# EAGLE design storm32-nt-v4 (EAGLE 6.1)

## Sheet 1 of 2
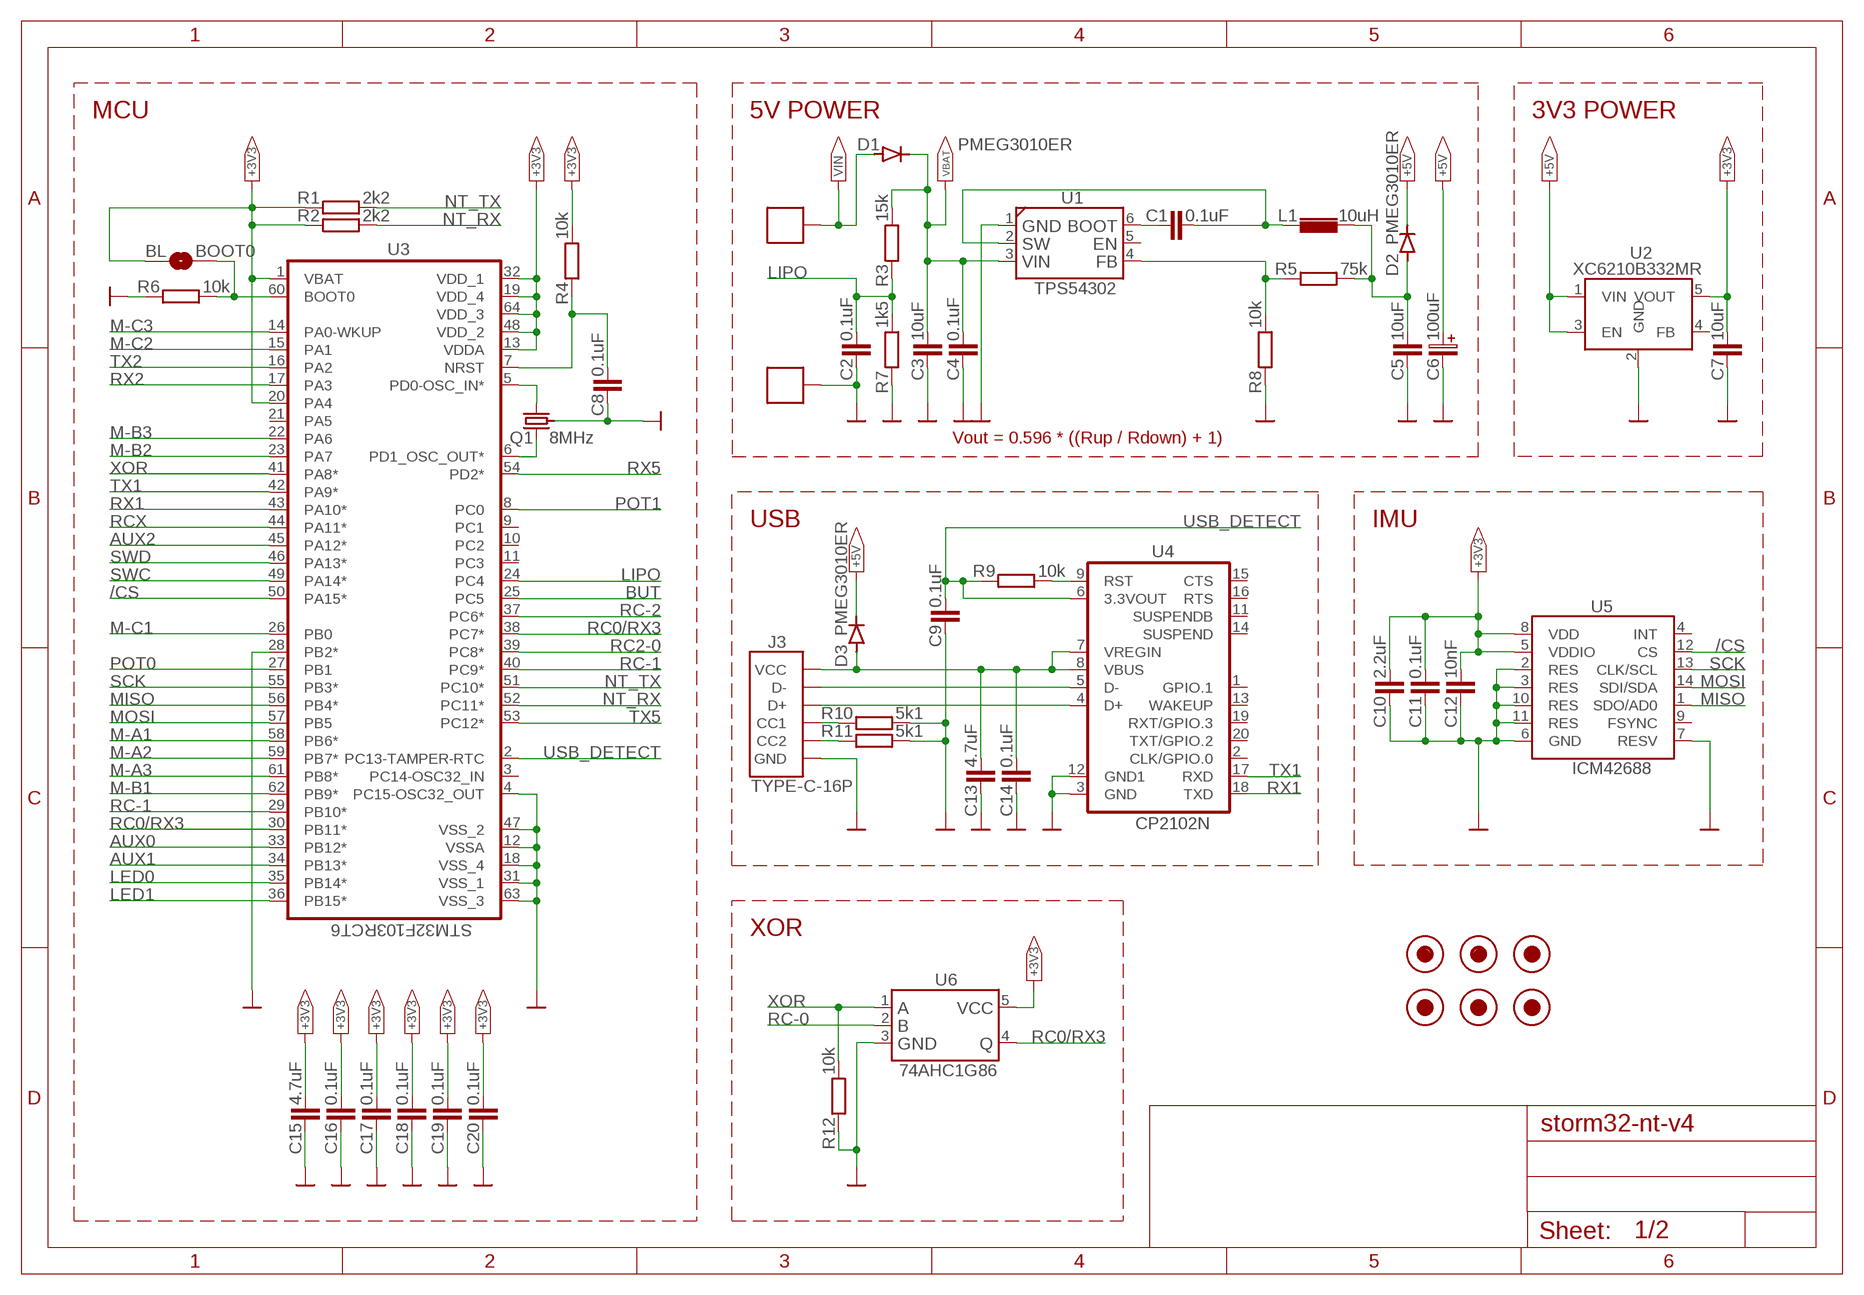
[diagram p0: schematic, sheet 1]

### Parts
BL  BOOT0  __SPARKFUN2_SOLDERJUMPERNO  [__SPARKFUN2_SJ_2S-NO]
C1  0.1uF  CAPACITOR-0402[1005-METRIC]  [0402[1005-METRIC]]
C2  0.1uF  CAPACITOR-0402[1005-METRIC]  [0402[1005-METRIC]]
C3  10uF  CAPACITOR-1206[3216-METRIC]  [1206[3216-METRIC]]
C4  0.1uF  CAPACITOR-0603[1608-METRIC]  [0603[1608-METRIC]]
C5  10uF  CAPACITOR-0603[1608-METRIC]  [0603[1608-METRIC]]
C6  100uF  CAPACITOR-POL-1206[3216-METRIC][CASE-A]  [1206[3216-METRIC]-POL]
C7  10uF  CAPACITOR-0603[1608-METRIC]  [0603[1608-METRIC]]
C8  0.1uF  CAPACITOR-0402[1005-METRIC]  [0402[1005-METRIC]]
C9  0.1uF  CAPACITOR-0402[1005-METRIC]  [0402[1005-METRIC]]
C10  2.2uF  CAPACITOR-0402[1005-METRIC]  [0402[1005-METRIC]]
C11  0.1uF  CAPACITOR-0402[1005-METRIC]  [0402[1005-METRIC]]
C12  10nF  CAPACITOR-0402[1005-METRIC]  [0402[1005-METRIC]]
C13  4.7uF  CAPACITOR-0402[1005-METRIC]  [0402[1005-METRIC]]
C14  0.1uF  CAPACITOR-0402[1005-METRIC]  [0402[1005-METRIC]]
C15  4.7uF  CAPACITOR-0402[1005-METRIC]  [0402[1005-METRIC]]
C16  0.1uF  CAPACITOR-0402[1005-METRIC]  [0402[1005-METRIC]]
C17  0.1uF  CAPACITOR-0402[1005-METRIC]  [0402[1005-METRIC]]
C18  0.1uF  CAPACITOR-0402[1005-METRIC]  [0402[1005-METRIC]]
C19  0.1uF  CAPACITOR-0402[1005-METRIC]  [0402[1005-METRIC]]
C20  0.1uF  CAPACITOR-0402[1005-METRIC]  [0402[1005-METRIC]]
D1  PMEG3010ER  DIODE-SOD-123  [SOD-123]
D2  PMEG3010ER  DIODE-SOD-123  [SOD-123]
D3  PMEG3010ER  DIODE-SOD-123  [SOD-123]
FIDUCIAL1  FIDUCIAL  [FIDUCIAL]
FIDUCIAL2  FIDUCIAL  [FIDUCIAL]
FIDUCIAL3  FIDUCIAL  [FIDUCIAL]
FIDUCIAL4  FIDUCIAL  [FIDUCIAL]
FIDUCIAL5  FIDUCIAL  [FIDUCIAL]
FIDUCIAL6  FIDUCIAL  [FIDUCIAL]
J1  +  1  [1]
J2  -  1  [1]
J3  TYPE-C-16P  [TYPE-C-16P]
L1  10uH  FERRITE/INDUCTOR-4X4  [4X4]
Q1  8MHz  CRYSTAL-GND-RESONATOR  [RESONATOR]
R1  2k2  RESISTOR-0402[1005-METRIC]  [0402[1005-METRIC]]
R2  2k2  RESISTOR-0402[1005-METRIC]  [0402[1005-METRIC]]
R3  15k  RESISTOR-0402[1005-METRIC]  [0402[1005-METRIC]]
R4  10k  RESISTOR-0402[1005-METRIC]  [0402[1005-METRIC]]
R5  75k  RESISTOR-0402[1005-METRIC]  [0402[1005-METRIC]]
R6  10k  RESISTOR-0402[1005-METRIC]  [0402[1005-METRIC]]
R7  1k5  RESISTOR-0402[1005-METRIC]  [0402[1005-METRIC]]
R8  10k  RESISTOR-0402[1005-METRIC]  [0402[1005-METRIC]]
R9  10k  RESISTOR-0402[1005-METRIC]  [0402[1005-METRIC]]
R10  5k1  RESISTOR-0402[1005-METRIC]  [0402[1005-METRIC]]
R11  5k1  RESISTOR-0402[1005-METRIC]  [0402[1005-METRIC]]
R12  10k  RESISTOR-0402[1005-METRIC]  [0402[1005-METRIC]]
U1  TPS54302  SOT23-6  [SOT-23-6]
U2  XC6210B332MR  REGULATOR_EN_FB  [SOT-23-5]
U3  STM32F103RCT6  [QFP50P1200X1200X160-64N]
U4  CP2102N  [QFN-20]
U5  ICM42688  ICM42605  [LGA14]
U6  74AHC1G86  SOT23-5  [SOT-23-5]

### Nets
+3V3: BL.2 C7.P$1 C10.P$1 C11.P$1 C12.P$1 C15.P$1 C16.P$1 C17.P$1 C18.P$1 C19.P$1 C20.P$1 R1.P$1 R2.P$1 R4.P$2 U2.5(VOUT) U3.1(VBAT) U3.13(VDDA) U3.19(VDD_4) U3.20(PA4) U3.32(VDD_1) U3.48(VDD_2) U3.64(VDD_3) U5.5(VDDIO) U5.8(VDD) U6.5 ; also sheet 2
+5V: C6.P D2.C D3.C U2.1(VIN) U2.3(EN) ; also sheet 2
/CS: U3.50(PA15*) U5.12(CS)
AUX0: U3.33(PB12*) ; also sheet 2
AUX1: U3.34(PB13*) ; also sheet 2
AUX2: U3.45(PA12*)
BUT: U3.25(PC5) ; also sheet 2
GND: C2.P$2 C3.P$2 C4.P$2 C5.P$2 C6.N C7.P$2 C8.P$2 C9.P$2 C10.P$2 C11.P$2 C12.P$2 C13.P$2 C14.P$2 C15.P$2 C16.P$2 C17.P$2 C18.P$2 C19.P$2 C20.P$2 J2.1 J2.1A J3.A1(GND) J3.A12(GND) J3.B1(GND) J3.B12(GND) J3.G1(GND) J3.G2(GND) J3.G3(GND) J3.G4(GND) Q1.G(GND) R6.P$1 R7.P$1 R8.P$1 R10.P$2 R11.P$2 R12.P$2 U1.1 U2.2(GND) U3.4(PC15-OSC32_OUT) U3.12(VSSA) U3.18(VSS_4) U3.28(PB2*) U3.31(VSS_1) U3.47(VSS_2) U3.63(VSS_3) U4.3(GND) U4.12(GND1) U5.2(RES) U5.3(RES) U5.6(GND) U5.7(RESV) U5.10(RES) U5.11(RES) U6.3 ; also sheet 2
LED0: U3.35(PB14*) ; also sheet 2
LED1: U3.36(PB15*) ; also sheet 2
LIPO: C2.P$1 R3.P$1 R7.P$2 U3.24(PC4)
M-A1: U3.58(PB6*) ; also sheet 2
M-A2: U3.59(PB7*) ; also sheet 2
M-A3: U3.61(PB8*) ; also sheet 2
M-B1: U3.62(PB9*) ; also sheet 2
M-B2: U3.23(PA7) ; also sheet 2
M-B3: U3.22(PA6) ; also sheet 2
M-C1: U3.26(PB0) ; also sheet 2
M-C2: U3.15(PA1) ; also sheet 2
M-C3: U3.14(PA0-WKUP) ; also sheet 2
MISO: U3.56(PB4*) U5.1(SDO/AD0)
MOSI: U3.57(PB5) U5.14(SDI/SDA)
N$1: J3.A5(CC1) R10.P$1
N$2: J3.B5(CC2) R11.P$1
N$3: C1.P$1 L1.1 U1.2
N$4: Q1.1 U3.6(PD1_OSC_OUT*)
N$5: Q1.2 U3.5(PD0-OSC_IN*)
N$6: C8.P$1 R4.P$1 U3.7(NRST)
N$7: C1.P$2 U1.6
N$9: J3.A6(D+) J3.B6(D+) U4.4(D+)
N$10: J3.A7(D-) J3.B7(D-) U4.5(D-)
N$11: C13.P$1 C14.P$1 D3.A J3.A4(VCC) J3.A9(VCC) J3.B4(VCC) J3.B9(VCC) U4.7(VREGIN) U4.8(VBUS)
N$12: R9.P$2 U4.9(RST)
N$13: R5.P$1 R8.P$2 U1.4
N$18: C5.P$1 D2.A L1.2 R5.P$2
N$29: BL.1 R6.P$2 U3.60(BOOT0)
NT_RX: R2.P$2 U3.52(PC11*) ; also sheet 2
NT_TX: R1.P$2 U3.51(PC10*) ; also sheet 2
POT0: U3.27(PB1) ; also sheet 2
POT1: U3.8(PC0) ; also sheet 2
RC0/RX3: U3.30(PB11*) U3.38(PC7*) U6.4
RC2-0: U3.39(PC8*) ; also sheet 2
RC-0: U6.2 ; also sheet 2
RC-1: U3.29(PB10*) U3.40(PC9*) ; also sheet 2
RC-2: U3.37(PC6*) ; also sheet 2
RCX: U3.44(PA11*)
RX1: U3.43(PA10*) U4.18(TXD)
RX2: U3.17(PA3) ; also sheet 2
RX5: U3.54(PD2*) ; also sheet 2
SCK: U3.55(PB3*) U5.13(CLK/SCL)
SWC: U3.49(PA14*) ; also sheet 2
SWD: U3.46(PA13*) ; also sheet 2
TX1: U3.42(PA9*) U4.17(RXD)
TX2: U3.16(PA2) ; also sheet 2
TX5: U3.53(PC12*) ; also sheet 2
USB_DETECT: C9.P$1 R9.P$1 U3.2(PC13-TAMPER-RTC) U4.6(3.3VOUT)
VBAT: C3.P$1 C4.P$1 D1.C R3.P$2 U1.3 ; also sheet 2
VIN: D1.A J1.1 J1.1A ; also sheet 2
XOR: R12.P$1 U3.41(PA8*) U6.1
Unconnected: U1.5 U2.4(FB) U3.3(PC14-OSC32_IN) U3.9(PC1) U3.10(PC2) U3.11(PC3) U3.21(PA5) U4.1(GPIO.1) U4.2(CLK/GPIO.0) U4.11(SUSPENDB) U4.13(WAKEUP) U4.14(SUSPEND) U4.15(CTS) U4.16(RTS) U4.19(RXT/GPIO.3) U4.20(TXT/GPIO.2) U5.4(INT) U5.9(FSYNC)

### Notes on the sheet
- MCU | 5V POWER | 3V3 POWER
- Vout = 0.596 * ((Rup / Rdown) + 1)
- USB | IMU
- XOR

## Sheet 2 of 2
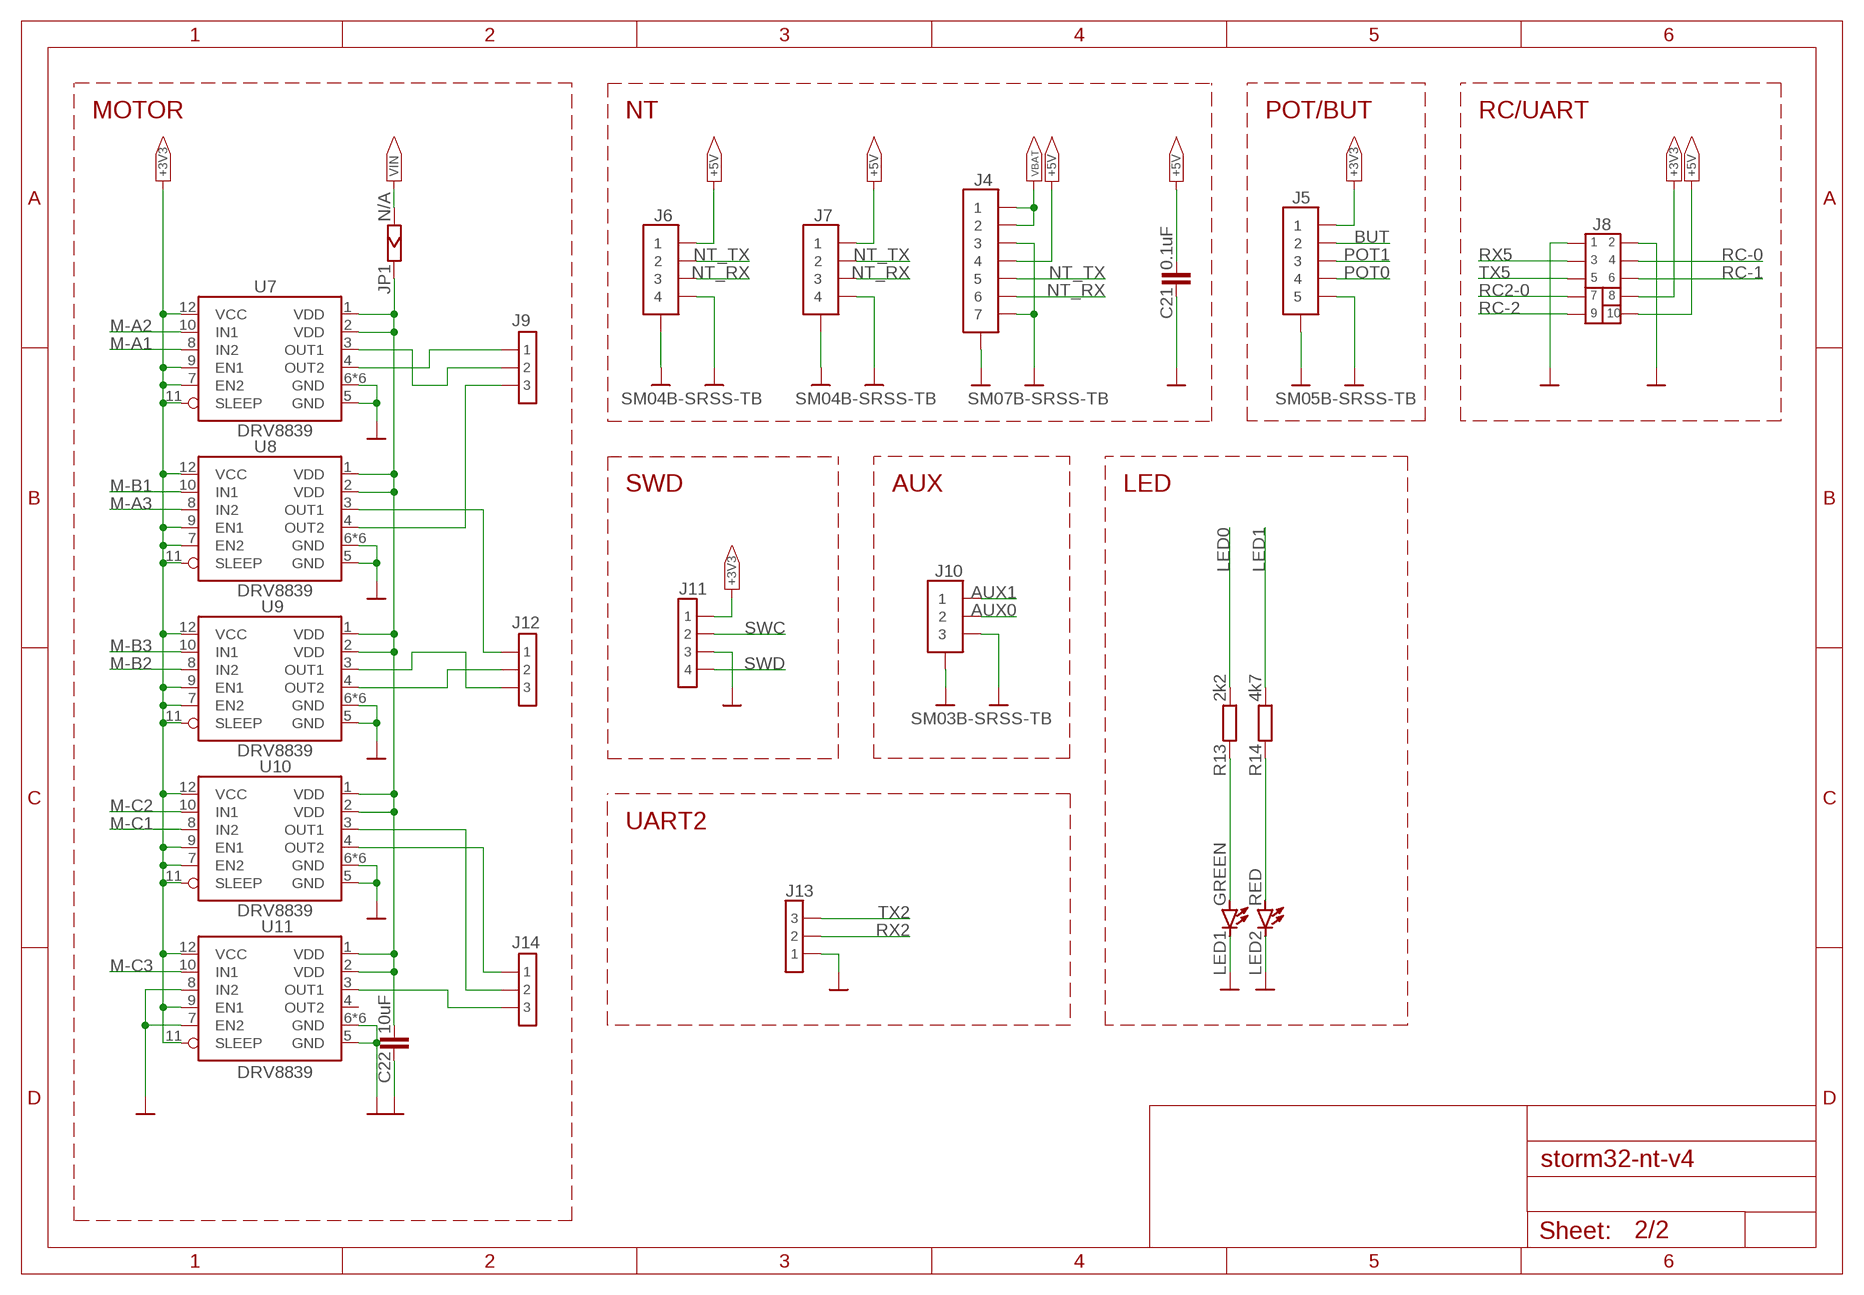
[diagram p1: schematic, sheet 2]

### Parts
C21  0.1uF  CAPACITOR-0402[1005-METRIC]  [0402[1005-METRIC]]
C22  10uF  CAPACITOR-1206[3216-METRIC]  [1206[3216-METRIC]]
J4  SM07B-SRSS-TB  [SM07B-SRSS-TB]
J5  SM05B-SRSS-TB  [SM05B-SRSS-TB]
J6  SM04B-SRSS-TB  [SM04B-SRSS-TB]
J7  SM04B-SRSS-TB  [SM04B-SRSS-TB]
J8  HEADER  [2X5]
J9  HEADER_THT_2.54X1N_MALE-03-2.54-2.54  [HEADER_THT_2.54X1N_MALE-03]
J10  SM03B-SRSS-TB  [SM03B-SRSS-TB]
J11  HEADER_THT_1.27X1N_MALE-04-1.27-1.27  [HEADER_THT_1.27X1N_MALE-04]
J12  HEADER_THT_2.54X1N_MALE-03-2.54-2.54  [HEADER_THT_2.54X1N_MALE-03]
J13  HEADER_THT_2.54X1N_MALE-03-2.54-2.54  [HEADER_THT_2.54X1N_MALE-03]
J14  HEADER_THT_2.54X1N_MALE-03-2.54-2.54  [HEADER_THT_2.54X1N_MALE-03]
JP1  N/A  RESISTOR-0OHM-OFF  [0603[1608-METRIC]-0OHM-OFF]
LED1  GREEN  LED-0603[1608-METRIC]  [0603[1608-METRIC]-DIODE]
LED2  RED  LED-0603[1608-METRIC]  [0603[1608-METRIC]-DIODE]
R13  2k2  RESISTOR-0402[1005-METRIC]  [0402[1005-METRIC]]
R14  4k7  RESISTOR-0402[1005-METRIC]  [0402[1005-METRIC]]
U7  DRV8839  [WSON12]
U8  DRV8839  [WSON12]
U9  DRV8839  [WSON12]
U10  DRV8839  [WSON12]
U11  DRV8839  [WSON12]

### Nets
+3V3: J5.1 J8.8 J11.1 U7.7(EN2) U7.9(EN1) U7.11(SLEEP) U7.12(VCC) U8.7(EN2) U8.9(EN1) U8.11(SLEEP) U8.12(VCC) U9.7(EN2) U9.9(EN1) U9.11(SLEEP) U9.12(VCC) U10.7(EN2) U10.9(EN1) U10.11(SLEEP) U10.12(VCC) U11.9(EN1) U11.11(SLEEP) U11.12(VCC) ; also sheet 1
+5V: C21.P$1 J4.4 J6.1 J7.1 J8.10 ; also sheet 1
AUX0: J10.2 ; also sheet 1
AUX1: J10.1 ; also sheet 1
BUT: J5.2 ; also sheet 1
GND: C21.P$2 C22.P$2 J4.3 J4.7 J4.FIT@1 J4.FIT@2 J5.5 J5.FIT@1 J5.FIT@2 J6.4 J6.FIT@1 J6.FIT@2 J7.4 J7.FIT@1 J7.FIT@2 J8.1 J8.2 J10.3 J10.FIT@1 J10.FIT@2 J11.3 J13.1 LED1.C LED2.C U7.5(GND) U7.6(GND) U7.GND1(GND) U7.GND2(GND) U7.GND3(GND) U7.GND4(GND) U7.GND5(GND) U8.5(GND) U8.6(GND) U8.GND1(GND) U8.GND2(GND) U8.GND3(GND) U8.GND4(GND) U8.GND5(GND) U9.5(GND) U9.6(GND) U9.GND1(GND) U9.GND2(GND) U9.GND3(GND) U9.GND4(GND) U9.GND5(GND) U10.5(GND) U10.6(GND) U10.GND1(GND) U10.GND2(GND) U10.GND3(GND) U10.GND4(GND) U10.GND5(GND) U11.5(GND) U11.6(GND) U11.7(EN2) U11.8(IN2) U11.GND1(GND) U11.GND2(GND) U11.GND3(GND) U11.GND4(GND) U11.GND5(GND) ; also sheet 1
LED0: R13.P$2 ; also sheet 1
LED1: R14.P$2 ; also sheet 1
M-A1: U7.8(IN2) ; also sheet 1
M-A2: U7.10(IN1) ; also sheet 1
M-A3: U8.8(IN2) ; also sheet 1
M-B1: U8.10(IN1) ; also sheet 1
M-B2: U9.8(IN2) ; also sheet 1
M-B3: U9.10(IN1) ; also sheet 1
M-C1: U10.8(IN2) ; also sheet 1
M-C2: U10.10(IN1) ; also sheet 1
M-C3: U11.10(IN1) ; also sheet 1
N$8: LED1.A R13.P$1
N$14: C22.P$1 JP1.P$2 U7.1(VDD) U7.2(VDD) U8.1(VDD) U8.2(VDD) U9.1(VDD) U9.2(VDD) U10.1(VDD) U10.2(VDD) U11.1(VDD) U11.2(VDD)
N$20: LED2.A R14.P$1
N$21: J9.1 U7.4(OUT2)
N$22: J9.2 U7.3(OUT1)
N$23: J9.3 U8.4(OUT2)
N$24: J12.1 U8.3(OUT1)
N$25: J12.2 U9.4(OUT2)
N$26: J12.3 U9.3(OUT1)
N$27: J14.2 U10.3(OUT1)
N$28: J14.1 U10.4(OUT2)
N$30: J14.3 U11.3(OUT1)
NT_RX: J4.6 J6.3 J7.3 ; also sheet 1
NT_TX: J4.5 J6.2 J7.2 ; also sheet 1
POT0: J5.4 ; also sheet 1
POT1: J5.3 ; also sheet 1
RC2-0: J8.7 ; also sheet 1
RC-0: J8.4 ; also sheet 1
RC-1: J8.6 ; also sheet 1
RC-2: J8.9 ; also sheet 1
RX2: J13.2 ; also sheet 1
RX5: J8.3 ; also sheet 1
SWC: J11.2 ; also sheet 1
SWD: J11.4 ; also sheet 1
TX2: J13.3 ; also sheet 1
TX5: J8.5 ; also sheet 1
VBAT: J4.1 J4.2 ; also sheet 1
VIN: JP1.P$1 ; also sheet 1
Unconnected: U11.4(OUT2)

### Notes on the sheet
- MOTOR | NT | POT/BUT | RC/UART
- SWD | AUX | LED
- UART2

## Library data of the parts
BL = SF:__SPARKFUN2_SOLDERJUMPER: Solder Jumper Standard SMD solder jumper. Used to automate production. Two varients : Normally Open and Normally Closed are the same, but have different paste layers. NC will have a large amount of paste and should jumper during reflow.
C1 C2 C4 C5 C7-C21 = REBANE:CAPACITOR: CAPACITOR
C3 C22 = REBANE:CAPACITOR: CAPACITOR; MOUSER: 81-GRM32ER71J106MA2L; VOLTAGE: 63
C6 = REBANE:CAPACITOR-POL: CAPACITOR-POL
D1-D3 = REBANE:DIODE: DIODE
FIDUCIAL1-FIDUCIAL6 = REBANE:FIDUCIAL: FIDUCIAL
J1 J2 = power_pin:1
J3 = usb-c:TYPE-C-16P
J4 = sm:SM07B-SRSS-TB
J5 = sm:SM05B-SRSS-TB
J6 J7 = sm:SM04B-SRSS-TB
J8 = storm4_io_header:HEADER
J9 J12-J14 = REBANE_HEADER_THT_2.54X1N_MALE:HEADER_THT_2.54X1N_MALE-03: "HEADER_THT_2.54X1N_MALE-03"
J10 = sm:SM03B-SRSS-TB
J11 = REBANE_HEADER_THT_1.27X1N_MALE:HEADER_THT_1.27X1N_MALE-04: "HEADER_THT_1.27X1N_MALE-04"
JP1 = REBANE:RESISTOR-0OHM
L1 = REBANE:FERRITE/INDUCTOR: FERRITE/INDUCTOR
LED1 LED2 = REBANE:LED: LED
Q1 = REBANE:CRYSTAL-GND: CRYSTAL
R1-R14 = REBANE:RESISTOR: RESISTOR
U1 = REBANE:SOT23-6; P1: GND; P2: SW; P3: VIN; P4: FB; P5: EN; P6: BOOT
U2 = REBANE:REGULATOR_EN_FB
U3 = STM32F103RCT6:STM32F103RCT6: ARM-based 32-bit MCU Check availability <https://pricing.snapeda.com/parts/STM32F103RCT6/STMicroelectronics/view-part?ref=eda>; AVAILABILITY: In Stock; DESCRIPTION: ARM® Cortex®-M3 STM32F1 Microcontroller IC 32-Bit 72MHz 256KB (256K x 8) FLASH 64-LQFP (10x10); MF: STMicroelectronics; MP: STM32F103RCT6; PACKAGE: LQFP-64 STMicroelectronics; PRICE: None; PURCHASE-URL: https://pricing.snapeda.com/search/part/STM32F103RCT6/?ref=eda
U4 = cp2102:CP2102N
U5 = ICM42605:ICM42605
U6 = REBANE:SOT23-5; P1: A; P2: B; P3: GND; P4: Q; P5: VCC
U7-U11 = DRV8839:DRV8839

## Board
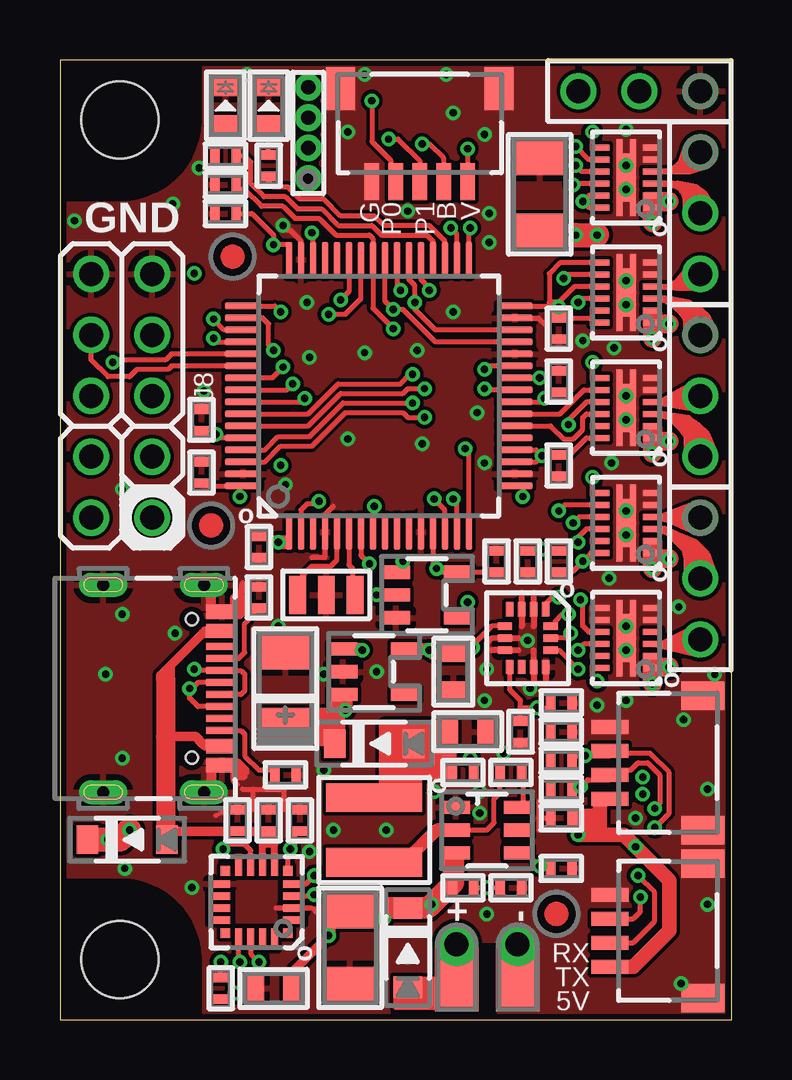
[diagram p2: board, top side]
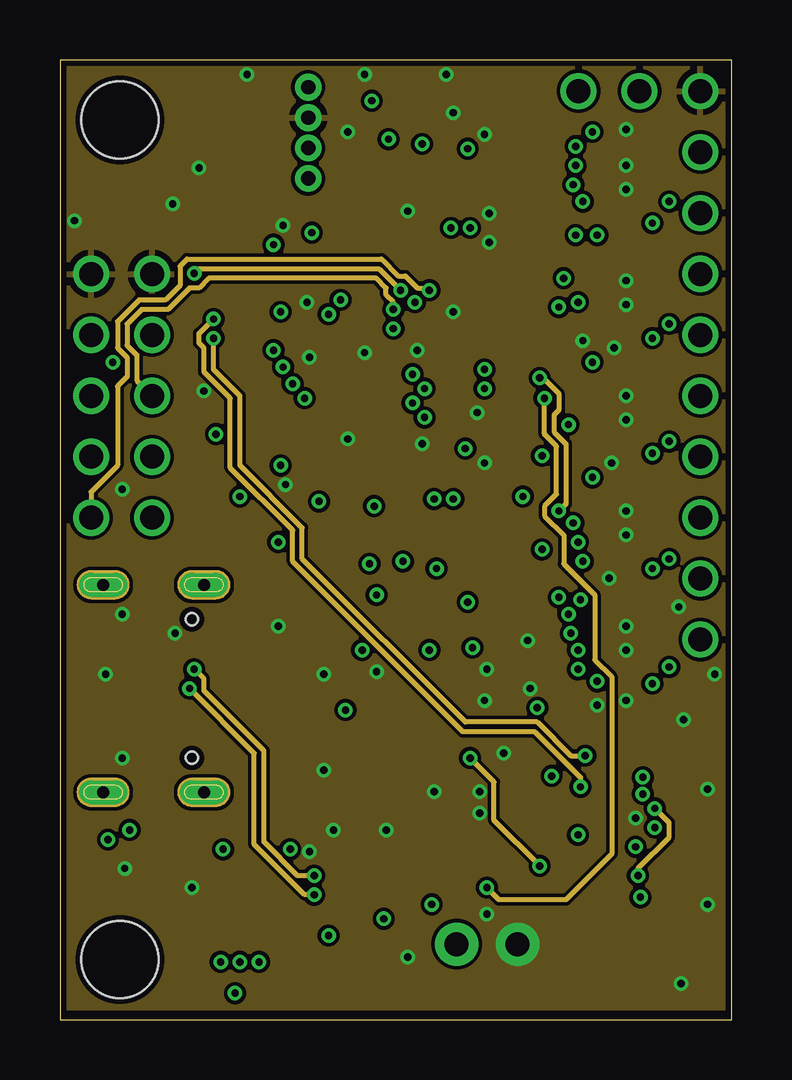
[diagram p3: board, inner layer Route2]
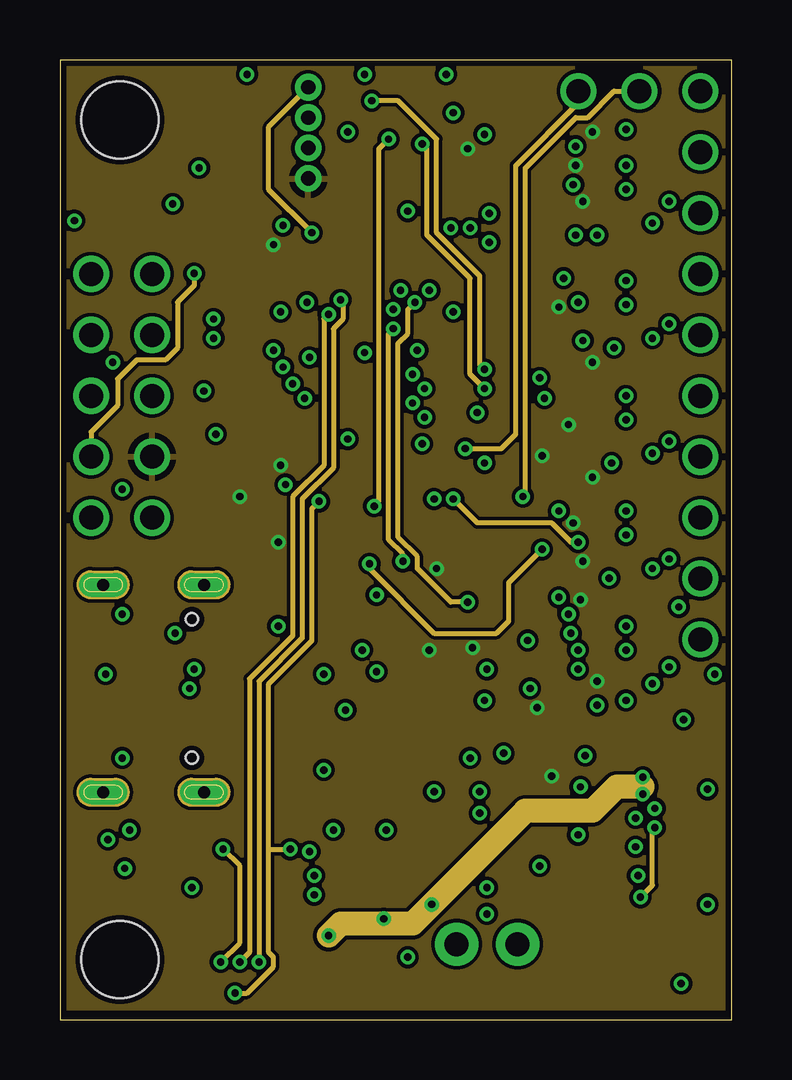
[diagram p4: board, inner layer Route15]
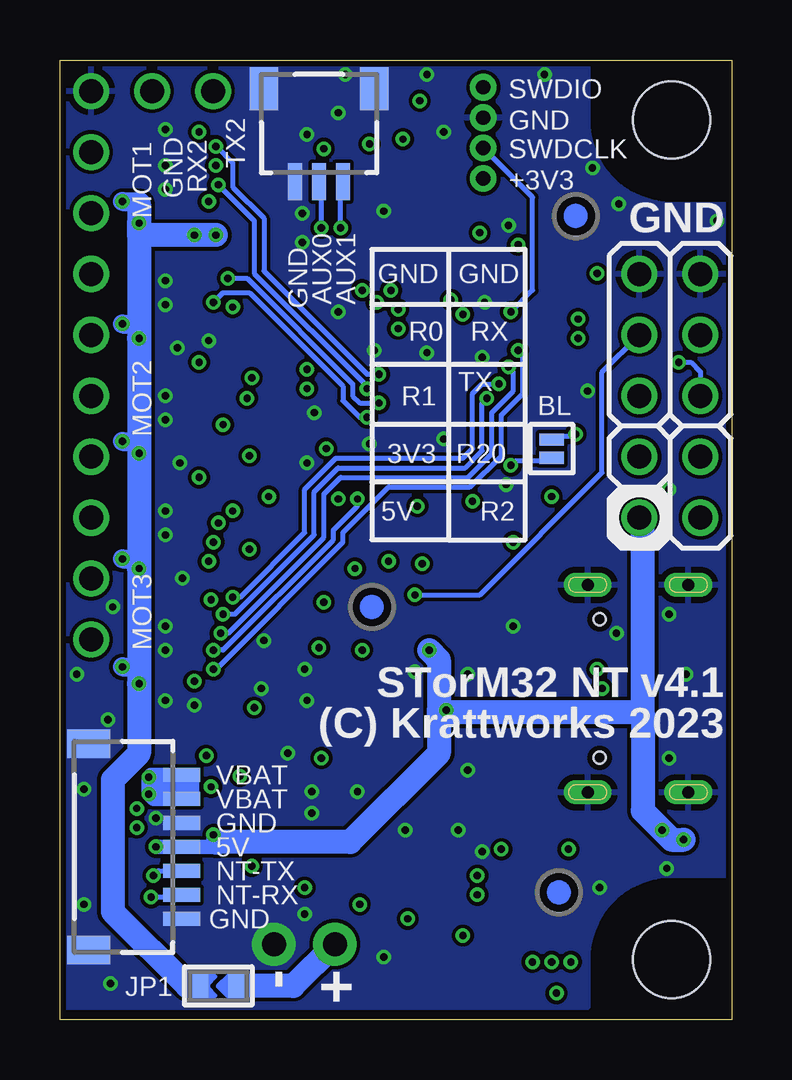
[diagram p5: board, bottom side, seen from below]

Size 28 x 40 mm. Coordinates in mm from the lower left corner, seen from the top.
Outline: 0,0 28,0 28,40 0,40 0,0
Copper layers (1+2*15+16): Top 0.035mm / dielectric 1.5mm / Route2 0.0175mm / dielectric 1.1mm / Route15 0.0175mm / dielectric 0.2mm / Bottom 0.035mm
Design rules: minimum track width 6mil, minimum drill 11mil, track to track 6mil, track to pad 6mil, pad to pad 6mil, via to via 6mil, smd to smd 0mil, copper to edge 10mil, drill to drill 10mil, minimum pad ring 10mil, minimum via ring 6mil, stop-mask expansion 2mil, vias tented up to drill 100mil, thermal gap 10mil
Holes 3.2 mm at 2.5,2.5 2.5,37.5
tRestrict: 1 lines

### Footprints (pad centres in the part's own frame; a part is rotated, then mirrored left to right if it is on the bottom)
__SPARKFUN2_SJ_2S-NO = smd 0.508 x 1.016: 1 -0.381,0; 2 0.381,0
0402[1005-METRIC] = smd 0.4 x 0.6: P$1 -0.45,0; P$2 0.45,0
1206[3216-METRIC] = smd 1.4 x 2: P$1 -1.5,0; P$2 1.5,0
0603[1608-METRIC] = smd 0.7 x 1: P$1 -0.75,0; P$2 0.75,0
1206[3216-METRIC]-POL = smd 1.4 x 2: N 1.5,0; P -1.5,0
SOD-123 = smd 0.9 x 1.2: A 1.65,0; C -1.65,0
1 = drill 1 pad 1.8: 1 0,0 | smd 1.8 x 2.8: 1A 0,-1.4
TYPE-C-16P = smd 0.3 x 1.3: A1 -3.35,1.25; A4 -2.55,1.25; A5 -1.25,1.25; A6 -0.25,1.25; A7 0.25,1.25; A8 1.25,1.25; A9 2.55,1.25; A12 3.35,1.25; B1 3.05,1.25; B4 2.25,1.25; B5 1.75,1.25; B6 0.75,1.25; B7 -0.75,1.25; B8 -1.75,1.25; B9 -2.25,1.25; B12 -3.05,1.25 | drill 0.5 long: G1 -4.325,0.5; G2 4.325,0.5; G3 -4.325,-3.7; G4 4.325,-3.7 | hole 0.5: -2.89,0; 2.89,0
SM07B-SRSS-TB = smd 0.6 x 1.55: 1 -3,2.975; 2 -2,2.975; 3 -1,2.975; 4 0,2.975; 5 1,2.975; 6 2,2.975; 7 3,2.975 | smd 1.2 x 1.8: FIT@1 -4.3,-0.9; FIT@2 4.3,-0.9
SM05B-SRSS-TB = smd 0.6 x 1.55: 1 -2,2.975; 2 -1,2.975; 3 0,2.975; 4 1,2.975; 5 2,2.975 | smd 1.2 x 1.8: FIT@1 -3.3,-0.9; FIT@2 3.3,-0.9
SM04B-SRSS-TB = smd 0.6 x 1.55: 1 -1.5,2.975; 2 -0.5,2.975; 3 0.5,2.975; 4 1.5,2.975 | smd 1.2 x 1.8: FIT@1 -2.8,-0.9; FIT@2 2.8,-0.9
2X5 = drill 1: 1 -1.27,5.08; 2 1.27,5.08; 3 -1.27,2.54; 4 1.27,2.54; 5 -1.27,0; 6 1.27,0; 7 -1.27,-2.54; 8 1.27,-2.54; 9 -1.27,-5.08; 10 1.27,-5.08
HEADER_THT_2.54X1N_MALE-03 = drill 1: 1 -2.54,0; 2 0,0; 3 2.54,0
SM03B-SRSS-TB = smd 0.6 x 1.55: 1 -1,2.975; 2 0,2.975; 3 1,2.975 | smd 1.2 x 1.8: FIT@1 -2.3,-0.9; FIT@2 2.3,-0.9
HEADER_THT_1.27X1N_MALE-04 = drill 0.6: 1 -1.905,0; 2 -0.635,0; 3 0.635,0; 4 1.905,0
0603[1608-METRIC]-0OHM-OFF = smd 0.7 x 1: P$1 -0.75,0; P$2 0.75,0
4X4 = smd 1.2 x 4: 1 -1.35,0; 2 1.35,0
0603[1608-METRIC]-DIODE = smd 0.7 x 1: A 0.75,0; C -0.75,0
RESONATOR = smd 0.7 x 1.6: 1 -1.2,0; 2 1.2,0; G 0,0
SOT-23-6 = smd 0.55 x 1.2: 1 -0.95,-1.3; 2 0,-1.3; 3 0.95,-1.3; 4 0.95,1.3; 5 0,1.3; 6 -0.95,1.3
SOT-23-5 = smd 0.55 x 1.2: 1 -0.95,-1.3; 2 0,-1.3; 3 0.95,-1.3; 4 0.95,1.3; 5 -0.95,1.3
QFP50P1200X1200X160-64N = smd 1.49 x 0.28: 1 -5.67,3.75; 2 -5.67,3.25; 3 -5.67,2.75; 4 -5.67,2.25; 5 -5.67,1.75; 6 -5.67,1.25; 7 -5.67,0.75; 8 -5.67,0.25; 9 -5.67,-0.25; 10 -5.67,-0.75; 11 -5.67,-1.25; 12 -5.67,-1.75; 13 -5.67,-2.25; 14 -5.67,-2.75; 15 -5.67,-3.25; 16 -5.67,-3.75; 33 5.67,-3.75; 34 5.67,-3.25; 35 5.67,-2.75; 36 5.67,-2.25; 37 5.67,-1.75; 38 5.67,-1.25; 39 5.67,-0.75; 40 5.67,-0.25; 41 5.67,0.25; 42 5.67,0.75; 43 5.67,1.25; 44 5.67,1.75; 45 5.67,2.25; 46 5.67,2.75; 47 5.67,3.25; 48 5.67,3.75 | smd 0.28 x 1.49: 17 -3.75,-5.67; 18 -3.25,-5.67; 19 -2.75,-5.67; 20 -2.25,-5.67; 21 -1.75,-5.67; 22 -1.25,-5.67; 23 -0.75,-5.67; 24 -0.25,-5.67; 25 0.25,-5.67; 26 0.75,-5.67; 27 1.25,-5.67; 28 1.75,-5.67; 29 2.25,-5.67; 30 2.75,-5.67; 31 3.25,-5.67; 32 3.75,-5.67; 49 3.75,5.67; 50 3.25,5.67; 51 2.75,5.67; 52 2.25,5.67; 53 1.75,5.67; 54 1.25,5.67; 55 0.75,5.67; 56 0.25,5.67; 57 -0.25,5.67; 58 -0.75,5.67; 59 -1.25,5.67; 60 -1.75,5.67; 61 -2.25,5.67; 62 -2.75,5.67; 63 -3.25,5.67; 64 -3.75,5.67
QFN-20 = smd 0.4 x 0.4: 1 -1.3,1.3; 6 -1.3,-1.3; 11 1.3,-1.3; 16 1.3,1.3 | smd 0.9 x 0.3: 2 -1.55,0.75; 3 -1.55,0.25; 4 -1.55,-0.25; 5 -1.55,-0.75; 12 1.55,-0.75; 13 1.55,-0.25; 14 1.55,0.25; 15 1.55,0.75 | smd 0.3 x 0.9: 7 -0.75,-1.55; 8 -0.25,-1.55; 9 0.25,-1.55; 10 0.75,-1.55; 17 0.75,1.55; 18 0.25,1.55; 19 -0.25,1.55; 20 -0.75,1.55
LGA14 = smd 0.6 x 0.3: 1 -1.2,0.75; 2 -1.2,0.25; 3 -1.2,-0.25; 4 -1.2,-0.75; 8 1.2,-0.75; 9 1.2,-0.25; 10 1.2,0.25; 11 1.2,0.75 | smd 0.3 x 0.6: 5 -0.5,-0.95; 6 0,-0.95; 7 0.5,-0.95; 12 0.5,0.95; 13 0,0.95; 14 -0.5,0.95
WSON12 = smd 0.8 x 0.25: 1 -1.1,1.25; 2 -1.1,0.75; 3 -1.1,0.25; 4 -1.1,-0.25; 5 -1.1,-0.75; 6 -1.1,-1.25; 7 1.1,-1.25; 8 1.1,-0.75; 9 1.1,-0.25; 10 1.1,0.25; 11 1.1,0.75; 12 1.1,1.25 | smd 0.8 x 2: GND1 0,0 | smd 0.25 x 0.8: GND2 -0.275,1.2; GND3 0.275,1.2; GND4 0.275,-1.2; GND5 -0.275,-1.2

### Placement (x,y rotation side)
BL  7.5,23.8 270 bottom
C1  18.8,10.3 0 top
C2  20.8,26.6 90 top
C3  12.1,3 270 top
C4  8.9,1.3 180 top
C5  17,12 0 top
C6  9.4,13.8 90 top
C7  16.4,14.5 270 top
C8  19.5,19.1 270 top
C9  10,8.3 90 top
C10  20.9,13.2 0 top
C11  20.9,12 0 top
C12  19.2,12 270 top
C13  8.7,8.3 90 top
C14  7.4,8.3 90 top
C15  8.3,19.7 270 top
C16  5.9,22.8 90 top
C17  18.2,19.1 90 top
C18  20.8,28.8 270 top
C19  6.9,33.6 180 top
C20  20.8,23.1 270 top
C21  20.9,8.4 180 top
C22  20,34.4 90 top
D1  14.5,3 270 top
D2  13.1,11.5 0 top
D3  2.8,7.5 0 top
FIDUCIAL1  7.2,31.8 0 top
FIDUCIAL2  20.7,4.4 0 top
FIDUCIAL3  6.3,20.6 0 top
FIDUCIAL4  7.2,5.3 0 bottom
FIDUCIAL5  6.5,33.5 0 bottom
FIDUCIAL6  15,17.2 0 bottom
FRAMEBRD1  [A5L-LOC]  -78.4,-52.5 0 top  (outside the outline)
J1  16.54,3.14 0 top
J2  19.08,3.14 0 top
J3  5.5,13.8 270 top
J4  25.9,7.2 270 bottom
J5  15,37.9 180 top
J6  25.9,10.7 90 top
J7  25.9,3.7 90 top
J8  2.57,26 0 top
J9  26.7,33.62 270 top
J10  17.2,37.9 180 bottom
J11  10.35,36.96 90 top
J12  26.7,26 270 top
J13  24.16,38.7 180 top
J14  26.7,18.38 270 top
JP1  21.4,1.4 180 bottom
L1  13.1,7.9 90 top
LED1  8.7,38.1 270 top
LED2  6.9,38.1 270 top
Q1  11.1,17.7 180 top
R1  20.9,9.6 0 top
R2  20.9,10.8 0 top
R3  16.8,5.5 180 top
R4  20.8,19.1 270 top
R5  16.8,10.3 180 top
R6  5.9,25 270 top
R7  18.8,5.5 180 top
R8  20.9,6.3 180 top
R9  6.7,1.3 90 top
R10  8.3,17.6 90 top
R11  9.4,10.2 0 top
R12  6.9,34.8 180 top
R13  8.7,35.6 270 top
R14  6.9,36 0 top
U1  17.8,7.9 270 top
U2  13.1,14.5 270 top
U3  13.3,26 90 top
U4  8.2,4.9 180 top
U5  19.5,15.9 270 top
U6  15.3,17.7 270 top
U7  23.6,35.1 180 top
U8  23.6,30.3 180 top
U9  23.6,25.5 180 top
U10  23.6,20.7 180 top
U11  23.6,15.9 180 top

### Tracks (layer width: path | path; a pad name or v marks a point on that pad's centre or on a via)
+3V3  (via drill 0.3)
  Top 0.2: U3.1 9.55,19.7 9.4,19.7 | 9.3,20 9.4,20 9.4,19.7 | 9.4,19.7 9.3,19.7 | 9.3,19.7 v9.1,19.9 | v9.1,19.9 9,20 | 7.5,22.25 v7.5,21.8 7.5,22.2 | U3.13 15.55,18.95 v15.7,18.8 15.85,18.65 U6.5 C17.P$1 | 16.4,15.5 C7.P$1 | v17.2,15.5 17.2,15.6 18,16.4 U5.5 | v15.4,15.4 15.4,15.5 | C12.P$1 19.2,13 | 19.2,13 19.2,13.3 18.75,13.75 U5.8 | U3.48 9.55,32.3 v8.9,32.3 8.9,32.7 8,33.6 C19.P$1 | U3.19 19.85,23.25 v20.1,23.5 | U3.20 19.85,23.75 v20.1,23.5 | U3.32 20.4,29.75 | 20.4,29.75 20.75,29.75 v20.8,29.7 | U11.9 22.05,16.15 21.8,16.4 21.8,17.4 v21.7,17.5 | 22.2,14.65 22.2,14.3 v22.4,14.1 | 22.2,14.65 U11.12 | U11.11 22.2,15.15 22.2,14.65 | R4.P$2 20.8,18.7 21.4,18.7 v21.8,19.1 22.15,19.45 U10.12 22.2,19.45 22.2,19.95 U10.11 | U9.11 22.2,24.75 22.2,24.25 U9.12 21.95,24.25 21.25,23.55 C20.P$1 20.8,23.5 v20.1,23.5 | U8.11 22.2,29.55 22.2,29.25 | U8.12 22.2,29.05 22.2,29.25 | R1.P$1 20.45,10.15 | 20.45,10.15 R2.P$1 C11.P$1 C10.P$1 20.45,13 v19.9,13 19.2,13 | 20.45,10.15 v20.5,10.15 | 9.3,19.7 9.1,19.7 | 9.1,20.1 9.5,20.1 | v9.1,19.9 9.1,19.7 | 9.1,19.7 9.2,19.8 9.2,20 9,20 | 9,20 9,19.8 | J5.1 v17,36.3 | U9.9 21.95,25.75 21.2,25 v21.2,24.8 | U9.7 22.2,26.75 v22.2,27.4 | U10.9 21.65,20.95 v21.4,20.7 | U10.7 22.2,21.95 v22.2,22.6 | v20.8,29.7 C18.P$1 21,29.25 | 21,29.25 22.2,29.25 | U8.9 21.45,30.55 20.8,29.9 v20.8,29.7 | U8.7 20.85,31.55 20.4,31.1 20.4,29.9 | 20.4,29.9 20.4,29.75 | U7.11 22.05,34.35 v21.8,34.1 22.05,33.85 U7.12 | U7.9 21.75,35.35 v21.5,35.6 | U7.7 22.2,36.35 v22.2,37 | C15.P$1 8.3,20.1 9.1,20.1 | 9.1,20.1 v9.1,19.9 | 5.9,22.3 C16.P$1 5.9,22.25 7.5,22.25 | 7.5,22.25 U3.64 | 20.6,29.25 20.6,29.7 v20.8,29.7 | 21,29.25 21,29.7 | 20.75,29.9 20.4,29.9
  Top 0.5: U2.5 15.35,15.45 v15.4,15.4 15.55,15.25 C7.P$1 16.95,15.25 v17.2,15.5
  Bottom 0.2: v9.2,23.1 9,23.3 7.5,23.3 BL.2 7.5,23.5
  pour Route15 (rank 2): 0.1,0.5 27.9,0.5 27.9,39.9 0.1,39.9
+5V  (via drill 0.3)
  Top 0.2: U2.3 11.75,13.7 11.3,13.7 11.3,11.7 | 11.3,11.5 10.7,11.5 10.5,11.7 | 10.5,11.7 10.1,11.7 | 10.5,11.7 11.3,11.7 | 11.3,11.7 11.3,11.5 | 11.3,11.5 11.8,11.5 U2.3 | U2.3 11.8,13.6 11.6,13.6 11.6,13.5 | 9.9,11.9 9.95,11.7 | D3.C 1.4,7.5 | 11.5,13.4 11.65,13.55 U2.3 | C6.P 9.9,12.3 | C21.P$1 21.5,8.5
  Top 0.5: U2.1 12.55,15.45 v12.6,15.4
  Top 0.6: 11.6,13.5 11.5,13.5 11.5,13.4 | 10.3,12.7 9.9,12.7 9.9,12.3 9.9,11.9 10.3,11.9 10.3,12.7 | 10.3,12.7 11.2,12.7 | 11.5,12.7 11.5,13.4 | 11.5,12.7 10.8,12.3 10.8,11.7 11.2,11.7 11.2,12.7 | 11.2,12.7 11.5,12.7 | 11.5,12.7 11.55,13.3 D2.C | v11.9,12.9 11.9,13.4 11.5,13.4 | 22.5,7.7 v21.6,7.7 21.6,8.5 | 22.5,7.7 22.5,8.1 | 22.5,8.5 22.5,9.2 J6.1 | 22.5,7.7 23.5,7.7 v24,7.2 25.4,5.8 25.4,3.7 23.9,2.2 J7.1 | 21.6,8.5 21.5,8.5 | 21.6,8.5 22.5,8.5 | 22.5,8.5 22.5,8.1 | 22.5,8.1 21.8,8.1
  Top 1: v2.9,7.9 2.5,7.5 v2,7.5 1.4,7.5
  Bottom 0.2: 21.6,7.2 21.6,7 21.3,7 21.3,7.4 21.4,7.4
  Bottom 0.6: 12.2,12.9 v11.9,12.9 | v21.6,7.7 21.6,7.2 J4.4 v24,7.2
  Bottom 1: 12.2,12.8 12.2,12.9 12.2,15 v12.6,15.4 | 12.2,12.8 12.2,11.1 15.9,7.4 21.4,7.4 | 3.7,12.8 3.7,8.7 2.5,7.5 v2,7.5 | 3.7,12.8 3.7,20.78 J8.10 | 3.7,12.8 12.2,12.8
/CS  (via drill 0.3)
  Top 0.2: v21.6,14.6 20.8,15.4 U5.12 | v8.9,27.9 8.7,28.1 8.7,29 8.45,29.25 U3.50
  Bottom 0.2: v21.6,14.6 21.5,14.6 16.2,19.9 16.2,20.3 14.3,22.2 10.9,22.2 9.6,23.5 9.6,25.2 8.7,26.1 8.7,27.7 v8.9,27.9
AUX0  (via drill 0.3)
  Top 0.2: U3.33 17.05,32.95 v17.1,33
  Bottom 0.2: v17.1,33 17.1,34.92 J10.2
AUX1  (via drill 0.3)
  Top 0.2: U3.34 16.55,32.75 v16.3,33
  Bottom 0.2: v16.3,33 16.3,34.92 J10.1
BUT  (via drill 0.3)
  Top 0.2: U3.25 17.75,26.25 v17.7,26.3 | J5.2 16,35.9 15.4,36.5 v15.1,36.5
  Route15 0.2: v17.7,26.3 17.1,26.9 17.1,30.9 15.3,32.7 15.3,36.3 v15.1,36.5
GND  (via drill 0.3)
  Top 0.2: U2.2 11.2,14.6 v11,14.4 | 10.5,19.26 11.05,19.26 U3.4 11.05,21.05 11.4,21.4 | U3.31 19.95,29.25 20.25,28.95 | U3.47 10.05,32.45 9.6,32.9 9.5,32.9 v9.3,33.1 | U5.6 18,15.9 17.8,15.7 17.8,15.5 | 9,4.65 10.5,4.65 10.7,4.45 | 8.06,16.3 8.06,14.3 | 19.96,8.4 19.96,7.9 | 19.96,9.1 19.96,9.04 | 19.96,9.04 19.96,8.4 | 19.96,8.4 C21.P$2 20.45,9.04 19.96,9.04 | J3.A1 6.4,17.15 | 6.4,17.15 6.2,17.15 6.2,18.12 J3.G1 | 7.2,17.15 7.2,17.6 7.25,17.65 | 7.25,17.65 7.4,17.8 | 6.4,10.45 J3.A12 6.75,10.6 7.3,10.6 | 6.4,10.45 6.2,10.45 6.2,9.47 J3.G2 | 7.2,10.3 7.2,10.8 7.4,10.8 7.8,10.4 | 7.2,10.3 7.2,10.2 | 7.2,10.2 7.2,10.1 | 7.2,10.1 7.2,10 7.4,9.8 | 8.05,8.75 8.05,9.6 | 9.35,8.75 9.35,9.6 8.05,9.6 | 7.6,9.6 8.05,9.6 | 6.4,17.15 6.4,18.12 | 6.4,10.45 6.4,9.47 | 7.3,10.6 7.3,10 | 7.2,10.3 7.7,10.3 | 7.3,17 7.3,17.6 7.25,17.6 7.25,17.65 | 7.65,18.05 7.25,17.15 7.2,17.15 | 7.25,17.35 7.5,17.55 | 7.5,17.55 7.6,18.2 | R10.P$2 7.65,18.05 | 7.65,18.05 7.5,17.55 | 7.2,10.2 7.7,10.2 7.3,10.6 | 7.2,10.1 7.7,10.1 | C14.P$2 6.95,8.75 6.5,8.5 | 7.4,10.7 7.8,10.3 | 7.7,17.6 7.7,17 7.5,16.8 7.2,16.8 7.2,17.15 | 7.6,17 7.6,17.6 | 7.5,16.9 7.5,17.55
  Top 0.25: 18,15.4 U5.7 19.1,15.4 | U5.6 19.1,15.9 | 19.25,17.8 U5.3 19.25,16.4 | 19.75,17.8 U5.2 19.75,16.4 | 19.75,14 U5.10 19.75,15.4 | U5.11 20.25,14
  other vias: 17.5,8.6 15.6,9.5 17.5,9.5 13.2,14.5 19.5,15.8 24,8.4 10.4,7 11,10.4 11.4,7.9 13.6,7.9 14.5,2.6 17.8,4.4 25.9,1.5 27,4.8 27,9.6 18.5,11.1 17.8,14.6 17.7,13.3 23.6,13.3 22.9,18.4 23,23.2 23.1,28 21.8,28.3 17.9,32.4 17.9,33.6 23.6,37.1 17.7,36.9 16.4,37.8 16.1,39.4 12,37 14.5,33.7 14.9,27.9 16.4,29.5 12.7,27.8 12,24.2 10.4,27.6 10.3,29.9 6,26.2 9.4,22.3 15.1,24 17.4,25.3 17.7,23.2 9.1,16.4 4.8,16.1 1.9,14.4 5.8,35.5 7.8,39.4 19.6,13.8 2.6,16.9 2.6,10.9 5.5,5.5 22.4,13.1 25.8,17.2 26,12.5 27.3,14.4 12.7,39.4 23.6,15.4 23.6,16.4 23.6,20.2 23.6,21.2 23.6,25 23.6,26 23.6,29.8 23.6,30.8 23.6,34.6 23.6,35.6 2.6,22.1 0.6,33.3 4.7,34 2.7,6.3
  pour Top (rank 2): 0.1,34 0.1,6 2.5,6 arc-90 6,2.5 6,0.1 14,0.1 14,0.5 17.3,0.5 17.3,3.3 18.3,3.3 18.3,0.1 27.9,0.1 27.9,39.9 6,39.9 6,37.5 arc-90 2.5,34
  pour Bottom (rank 2): 6,0.5 27.9,0.5 27.9,39.9 6,39.9 6,37.5 arc-90 2.5,34 0.1,34 0.1,6 2.5,6 arc-90 6,2.5
  pour Route2: 0.1,0.5 27.9,0.5 27.9,39.9 0.1,39.9
LED0
  Top 0.2: U3.35 16.05,32.45 15.4,33.1 13.5,33.1 13.1,33.5 11.7,33.5 11,34.2 10,34.2 9.5,34.7 8.9,34.7 8.7,34.9 R13.P$2 8.85,35.05
LED1
  Top 0.2: U3.36 15.55,32.45 15.3,32.7 13.4,32.7 13,33.1 11.6,33.1 10.9,33.8 9.9,33.8 9.4,34.3 8.5,34.3 7.95,34.85 7.95,35.75 7.7,36 R14.P$2
LIPO  (via drill 0.3)
  Top 0.2: R3.P$1 v17.8,5.5 R7.P$2 | U3.24 20.05,25.75 v20.2,25.9 20.35,26.05 20.8,26.05 C2.P$1
  Route2 0.2: v20.2,25.9 20.2,24.4 20.7,23.9 20.7,21.9 20.2,21.4 20.2,21 21,20.2 21,19 22.3,17.7 22.3,15 23,14.3 23,6.9 21.1,5 18.3,5 v17.8,5.5
M-A1  (via drill 0.3)
  Top 0.2: U7.8 22.05,35.85 v21.5,36.4 | U3.58 10.35,25.25 11.6,26.5 14.2,26.5 14.6,26.9 v14.7,26.9
  Bottom 0.2: v21.5,36.4 20.8,35.7 20.8,34.7 19.5,33.4 19.5,31.2 15.2,26.9 v14.7,26.9
M-A2  (via drill 0.3)
  Top 0.2: U7.10 21.45,34.85 v21.4,34.8 | U3.59 10.35,24.75 11.7,26.1 14.3,26.1 14.5,26.3 v15.2,26.3
  Bottom 0.2: v21.4,34.8 19.9,33.3 19.9,31.1 15.2,26.4 v15.2,26.3
M-A3  (via drill 0.3)
  Top 0.2: U8.8 21.15,31.05 v21,30.9 | U3.61 8.55,23.75 9.1,24.3 10.4,24.3 11.8,25.7 v14.7,25.7
  Bottom 0.2: v21,30.9 20.2,30.9 15.8,26.5 15.8,26 15.5,25.7 v14.7,25.7
M-B1  (via drill 0.3)
  Top 0.2: U8.10 21.75,30.05 v21.6,29.9 | U3.62 8.55,23.25 9.2,23.9 10.5,23.9 11.9,25.3 14.3,25.3 14.5,25.1 v15.2,25.1
  Bottom 0.2: v21.6,29.9 21.2,30.3 20.1,30.3 16.2,26.4 16.2,25.8 15.5,25.1 v15.2,25.1
M-B2
  Top 0.2: U3.23 20.85,25.25 21.85,26.25 U9.8
M-B3
  Top 0.2: U3.22 20.45,24.75 21,24.2 21.4,24.2 21.8,24.6 21.8,25.1 21.95,25.25 U9.10
M-C1  (via drill 0.3)
  Top 0.2: U10.8 21.05,21.45 v20.8,21.2 | U3.26 v20,26.75
  Route2 0.2: v20,26.75 20.15,26.75 20.8,26.1 20.8,25.4 20.6,25.2 20.6,24.5 21.1,24 21.1,21.5 v20.8,21.2
M-C2  (via drill 0.3)
  Top 0.2: U3.15 16.55,21.55 v16.4,21.7 | U10.10 21.95,20.45 21.6,20.1 v21.6,19.9
  Route15 0.2: v21.6,19.9 21.3,19.9 20.5,20.7 17.4,20.7 v16.4,21.7
M-C3  (via drill 0.3)
  Top 0.2: U11.10 21.85,15.65 v21.6,15.4 | U3.14 16.05,21.25 v15.6,21.7
  Bottom 0.2: v21.6,15.4 21.2,15.4 16.6,20 16.6,20.4 15.6,21.4 v15.6,21.7
MISO  (via drill 0.3)
  Top 0.2: v20.8,17.6 20.5,17.6 20.25,17.35 U5.1 | U3.56 9.45,26.25 v9.7,26.5
  Bottom 0.2: v20.8,17.6 20.5,17.6 17.8,20.3 17.8,22.1 16.5,23.4 11.2,23.4 10.8,23.8 10.8,26.1 10.4,26.5 v9.7,26.5
MOSI  (via drill 0.3)
  Top 0.2: v21.2,16.9 20.95,16.9 20.65,16.6 20.65,16.4 U5.14 | U3.57 10.05,25.75 v10.2,25.9
  Bottom 0.2: v21.2,16.9 20.7,16.9 17.4,20.2 17.4,22 16.4,23 11.1,23 10.4,23.7 10.4,25.7 v10.2,25.9
N$1
  Top 0.2: J3.A5 7.45,15.05 7.7,15.3 7.7,16.5 8.1,16.9 8.1,17.15 R10.P$1
N$2
  Top 0.2: J3.B5 7.55,12.05 7.7,11.9 7.7,11 8.3,10.4 8.95,10.4 R11.P$1
N$3
  Top 0.2: U1.2 17.8,7.9 18.1,8.2 18.1,9.2 18.35,9.45 C1.P$1
  Top 0.55: U1.2 15.7,7.9 14.35,6.55 L1.1
N$4
  Top 0.2: U3.6 12.05,18.95 12.2,18.8 12.2,17.7 Q1.1
N$5
  Top 0.2: Q1.2 10.1,17.7 10.1,18.5 10.5,18.9 11.3,18.9 11.55,19.15 U3.5
N$6  (via drill 0.3)
  Top 0.2: U3.7 12.55,19.35 v12.9,19 | C8.P$1 20.1,19.55 | R4.P$1 20.1,19.55 | 20.1,19.55 v20.1,19.6
  Route15 0.2: v20.1,19.6 18.7,18.2 18.7,16.6 18.2,16.1 15.6,16.1 12.9,18.8 v12.9,19
N$7
  Top 0.2: C1.P$2 19.3,10.3 19.3,8.85 U1.6
N$8
  Top 0.2: R13.P$1 LED1.A
N$9  (via drill 0.3)
  Top 0.2: U4.4 10.55,5.15 v10.6,5.2 | J3.A6 5.75,14.05 5.5,13.8 v5.4,13.8 5.4,13.4 5.75,13.05 J3.B6
  Route2 0.2: v10.6,5.2 10.2,5.2 8.1,7.3 8.1,11.1 v5.4,13.8
N$10  (via drill 0.3)
  Top 0.2: U4.5 10.25,5.65 v10.6,6 | J3.A7 7.55,13.55 7.7,13.7 7.7,14.4 7.55,14.55 J3.B7 5.65,14.55 v5.6,14.6
  Route2 0.2: v10.6,6 9.9,6 8.5,7.4 8.5,11.2 6,13.7 6,14.2 v5.6,14.6
N$11
  Top 0.2: 6.75,11.4 J3.B4 | 6.7,11.4 6.75,11.4 | 6.75,11.4 J3.A9 | 6.75,16.2 J3.A4 | 6.7,16.2 6.75,16.2 | 6.75,16.2 J3.B9 | 4.7,14.8 4.7,14.1 4.5,14.1 4.4,14.2
  Top 0.3: U4.8 8.45,7.85 C13.P$1 8.5,7.85 8.5,7.9 8.95,7.9 8.95,7.6 | U4.7 8.95,7.3 | 8.95,7.3 8.95,7.6 | 8.95,7.6 8.5,7.6 | 8.95,7.3 8.5,7.3
  Top 0.4: 6.7,11.4 6.05,11.4 5.95,11.5 | 5.95,11.5 5.65,11.8 4.4,11.8 | 6.7,16.2 6.05,16.2 5.95,16.1 | 5.95,16.1 4.4,14.55 | 4.4,14.55 4.4,14.25 | 4.4,7.6 D3.A 4.7,7.6 4.7,7.85 C14.P$1 C13.P$1 | 4.4,14.55 4.2,14.35 | 6.7,11.5 5.95,11.5 | 6.6,16.1 5.95,16.1
  Top 0.8: 4.4,14.25 4.4,14.2 4.4,11.8 4.4,7.6
N$12  (via drill 0.3)
  Top 0.2: U4.9 7.95,7.05 7.7,7.3 7,7.3 v6.8,7.1 | R9.P$2 v6.7,2.4
  Route15 0.2: v6.7,2.4 7.5,3.2 7.5,6.4 v6.8,7.1
N$13  (via drill 0.3)
  Top 0.2: R5.P$1 17.2,10.3 17.2,10.8 v17.1,10.9 | U1.4 19.1,6.8 19.6,6.8 v20,6.4 20.45,6.4 R8.P$2
  Route2 0.2: v20,6.4 18.1,8.3 18.1,9.9 v17.1,10.9
N$14  (via drill 0.3)
  Top 0.2: 24.7,14.7 24.4,14.7 24.4,15.1 24.7,15.1 U11.2 U11.1 | U10.1 24.7,19 24.4,19 24.4,19.65 | 24.4,19.65 24.4,19.75 | 24.4,19.75 24.4,19.95 U10.2 25,19.95 25,19.75 | 25,19.75 25,19.65 | 25,19.65 25,19.2 | 24.4,19.75 25,19.75 | 24.4,19.65 25,19.65 | U9.1 24.4,24.25 24.4,24.5 | 24.4,24.5 24.4,24.6 | 24.4,24.6 24.4,24.7 24.7,24.7 | 24.7,24.7 25,24.7 25,24.6 | 25,24.6 25,24.5 | 25,24.5 25,24.1 | 24.4,24.5 25,24.5 | 24.4,24.6 25,24.6 | 24.7,24.7 U9.2 | U7.1 24.4,33.85 24.4,34.4 25.3,34.4 25.3,34 24.7,34 | 24.7,34.1 U7.2 | U8.1 24.4,29.05 24.4,29.4 | 24.4,29.4 24.4,29.5 24.7,29.5 | 24.7,29.5 25,29.5 25,29.4 | 25,29.4 25,29 | 24.4,29.4 25,29.4 | 24.7,29.5 U8.2
  Top 0.8: v24.7,14 U11.1 24.7,14.7 v25.4,14.7 | v25.4,19.2 25,19.2 24.7,19.2 24.7,19 v24.7,18.8 | v25.4,24.1 25,24.1 24.7,24.1 v24.7,23.6 | v25.4,29 25,29 24.7,29 v24.7,28.4 | v24.7,33.2 U7.1 24.7,34 24.7,34.1 v25.4,34.1
  Top 1: C22.P$1 20,32.7 v21.5,32.7 v22.4,32.7
  Bottom 0.2: 22.3,1.4 JP1.P$2
  Bottom 0.8: v25.4,14.7 24.7,14.7 | v25.4,19.2 24.7,19.2 | v25.4,24.1 24.7,24.1 | v25.4,29 24.7,29 | v25.4,34.1 24.7,34.1 24.7,34
  Bottom 1: 24.7,34 v24.7,33.2 24.7,32.7 | 24.7,32.7 24.7,29 v24.7,28.4 24.7,24.1 24.7,19.2 v24.7,18.8 24.7,14.7 v24.7,14 24.7,11.1 25.8,10 25.8,4.5 22.7,1.4 22.3,1.4 | v21.5,32.7 24.7,32.7
N$18
  Top 0.2: 14.6,12.2 14.75,12.2 D2.A | 16.25,12.2 C5.P$1 16.35,12 16.35,11.7 | 15.1,10.2 15.5,10.2 15.5,10.3 | 16.3,10.2 16,10.2 16,10.3
  Top 0.4: R5.P$2 16.35,11.7 15.1,11.7 15.1,10.2 | 15.1,10.2 16.3,10.2 | 15.1,10.2 14.9,10.2 14.9,9.5
  Top 0.6: L1.2 14.6,9.25 14.6,12.2 | 14.6,12.2 14.8,12.2 | 14.8,12.2 16.25,12.2 | 15.5,10.3 15.5,12.1 | 16,10.3 16,12.1 | 14.6,12.2 14.1,12.2 | 14.1,9.6 14.1,12.2 | 14.1,12.2 13.6,12.2 13.6,9.7 | 14.8,9.25 14.8,12.2
N$20
  Top 0.2: R14.P$1 6.5,36 6.5,36.5 6.8,36.8 6.8,37.35 LED2.A
N$21
  Top 0.25: 25.45,35.35 26.1,35.9 | 26.1,35.9 26.1,36.3 | J9.1 27,36.16 27,35.6 26.25,35.35 26,35.35 | 26,35.35 25.45,35.35 | 25.45,35.35 U7.4 | 25.94,35.5 26.5,35.5 | 26.04,35.7 26.1,35.7 | 26.1,35.7 26.6,35.7 | 25.94,35.5 26,35.44 26,35.35 | 26.1,35.9 26.1,35.7 | 25.7,35.5 25.94,35.5 | 25.84,35.6 26.1,36.3 | 26.1,36.3 26.14,36.4
N$22
  Top 0.2: 25.95,34.65 25.95,34.7 26.2,34.7
  Top 0.25: 25.55,34.85 U7.3 25.25,34.85 25.8,34.7 | 25.55,34.85 25.75,34.85 | 25.75,34.85 25.75,34.75 | 25.75,34.75 27.1,34.1 | 27.1,34.1 27.1,34 27.2,34 | 27.2,34 27.2,33.6 | J9.2 26.1,33.62 | 26.1,33.62 26.1,33.6 | 26.1,33.62 26.1,34.2 26,34.5 | 26,34.5 25.9,34.6 | 25.9,34.6 25.8,34.7 | 25.9,34.6 26.4,33.9 26.6,33.9 | 25.9,34.6 25.55,34.85 | 26.6,33.9 26,34.5 | 25.8,34.7 25.75,34.75 | 25.95,34.65 26.9,33.9 26.7,33.7 J9.2 | 26.15,34.45 27.1,33.9 27.2,34 | 26.6,33.9 26.7,33.8 26.7,33.72 | 26.7,33.72 J9.2 | 26.6,33.6 27.1,34.1 | 27.1,34.1 26.9,34.4 26.5,34.7 25.75,34.85 | 26.7,33.72 26.1,33.72 | 26.6,34.4 26.2,34.7
N$23
  Top 0.25: U8.4 25.35,30.55 | 25.35,30.55 26.3,31.1 | J9.3 26.7,30.7 | 26.7,30.7 26.7,30.5 25.7,30.5 25.35,30.55 | 26.7,30.7 25.7,30.7 25.6,30.6 26.4,31.6
N$24
  Top 0.2: 26.5,29.2 26.49,29.2 26.49,29.19 | 26.91,28.75 26.8,28.75 26.8,29 | 26.4,29.5 26.39,29.5 26.39,29.49 | 26.2,29.7 26.13,29.7 26.13,29.64
  Top 0.25: 25.25,30.05 25.45,30.05 26.2,29.9 26.7,29.6 27,29.3 27.3,28.7 | 25.25,30.05 26.1,29.3 26.16,28.24 J12.1 26.91,28.75 26.95,28.75 26.15,29.17 | 25.25,30.05 25.1,30.05 | 25.1,30.05 24.9,30.05 | 24.9,30.05 U8.3 | 25.75,29.85 24.9,30.05 | 26.55,29.15 26.49,29.19 25.1,30.05 | 26.15,29.17 25.6,29.85 | 25.86,29.8 26.26,28.86 | 26.36,28.66 26.06,29.4 26.16,29 25.86,29.8 | 25.86,29.8 25.93,29.47 26.15,29.17 | 26.3,29.6 26.39,29.49 26.8,29 | 26,29.8 26.13,29.64 26.5,29.2 | 26.2,29.7 26.7,29.4 | 26.4,29.5 26.9,29.2
N$25
  Top 0.2: U9.4 26.7,25.4 J12.2 | J12.2 26.7,26.6 26.5,26.6 25.1,25.8 26.2,25.6 26,26.2 25.4,25.9 26,25.8 25.9,26 | 25.9,26 25.7,26 | 25.9,26 J12.2
N$26
  Top 0.2: U9.3 25.4,25.1 25.8,24.7 26.1,24.3 | 26.1,24.3 26.1,24.1 | 25.1,25.27 26.2,25.1 26.6,24.8 27,24.4 27.3,23.7 27.3,23.4 26.1,23.4 26.1,24.1 | J12.3 27.1,23.46 27.1,24.1 26.5,24.1 | 26.5,24.1 26.2,24.1 | 26.2,24.1 26.2,24.2 27,24.2 27,24.3 26.1,24.3 | 26.1,24.3 26.1,24.5 26.9,24.5 26.9,24.4 26.7,24.4 26.7,24.7 26.5,24.7 | 26.1,24.7 26,24.7 26,24.6 25.9,24.6 25.9,24.8 26.3,24.8 | 26.5,24.8 26.3,24.8 | 26.3,24.8 26.3,25 25.8,25 25.8,24.9 25.6,24.9 25.6,25.1 26.1,25.1 26.1,24.7 | 26.1,24.7 26.5,24.7 | 26.5,24.7 26.5,24.1 | 26.2,24.1 26.1,24.1
N$27
  Top 0.2: U10.3 25.3,20.3 26,19.6 | 26,19.6 26.1,19.2 26.1,18.3 26.4,18.3 | 24.5,20.47 25.2,20.47 25.8,20.2 26.5,19.9 27,19.4 27.3,18.6 27.3,18.3 26.4,18.3 | J14.2 27.1,18.38 27.1,19.1 26.9,19.3 | 26.9,19.3 26.9,19.5 | 26.9,19.3 26.9,19 26.2,19 26.2,19.2 26.8,19.2 26.8,19.3 26.1,19.3 26.1,19.5 26.8,19.5 26,19.6 | 26,19.6 26,19.7 26.1,19.7 | 26.4,19.7 26.6,19.7 26.6,19.8 25.9,19.8 25.9,19.9 26.2,19.9 26.2,20 26.1,20 | 25.7,20.1 25.7,20.2 25.6,20.2 25.6,20.1 25.7,20.1 | 25.7,20.1 25.7,20 26.1,20 | 26.1,20 26.1,19.7 | 26.1,19.7 26.4,19.7 | 26.4,19.7 26.4,18.3
N$28
  Top 0.2: U10.4 25.4,20.8 26.5,20.3 26.4,21.5 25.1,21 26.4,20.5 26.3,21.3 25.4,21 26.3,20.7 26.2,21.1 25.8,21 26.2,20.9 J14.1
N$29  (via drill 0.3)
  Top 0.2: U3.60 6.65,24.25 v6.5,24.4 6.45,24.45 5.9,24.45 R6.P$2
  Bottom 0.2: v6.5,24.4 6.6,24.3 7.5,24.3 BL.1
N$30
  Top 0.2: U11.3 26.6,15.2 26.7,16.5 24.9,15.6 26.5,15.4 26.5,16.3 25.3,15.7 26.4,15.6 26.4,16.2 25.7,15.8 26.3,15.7 26.3,16 26,15.9 J14.3
NT_RX  (via drill 0.3)
  Top 0.2: J7.3 23.9,4.2 24.2,4.5 v24.2,5.1 | R2.P$2 21.35,11 v21.9,11 22.93,11 J6.3 22.93,11.1 24.6,11.1 25.4,10.3 25.4,8.6 v24.8,8 | v6.4,28.4 6.55,28.25 U3.52
  Route2 0.2: v21.9,11 21.3,11 19.9,12.4 16.9,12.4 10.1,19.2 10.1,20.5 7.5,23.1 7.5,26 6.4,27.1 v6.4,28.4
  Route15 0.2: v24.2,5.1 24.7,5.6 24.7,7.9 v24.8,8
  Bottom 0.2: J4.6 22.93,5.1 v24.2,5.1
NT_TX  (via drill 0.3)
  Top 0.2: J7.2 23.9,3.2 24.8,4.1 24.8,5.3 v24.1,6 | R1.P$2 v21.7,9.7 22,10 22.93,10 J6.2 22.93,10.4 23.8,10.4 24.1,10.7 24.5,10.7 25,10.2 25,9 v24.8,8.8 | U3.51 6.85,28.75 v6.4,29.2
  Route2 0.2: v24.1,6 24.1,6.3 25.4,7.6 25.4,8.2 v24.8,8.8 | v21.7,9.7 21.7,10.1 19.8,12 16.8,12 9.7,19.1 9.7,20.4 7.1,23 7.1,25.9 6,27 6,28 5.8,28.2 5.8,28.6 v6.4,29.2
  Bottom 0.2: v24.1,6 23.9,6.2 J4.5
POT0  (via drill 0.3)
  Top 0.2: U3.27 17.85,27.25 v17.7,27.1 | v13,38.3 13,36.6 13.8,35.8 13.8,34.92 J5.4
  Route15 0.2: v17.7,27.1 17.5,27.3 17.5,31 15.7,32.8 15.7,36.7 14.1,38.3 v13,38.3
POT1  (via drill 0.3)
  Top 0.2: U3.8 13.05,21.35 v13.1,21.4 | v13.7,36.7 14.1,36.7 15,35.8 J5.3
  Route15 0.2: v13.1,21.4 13.3,21.6 13.3,36.3 v13.7,36.7
RC0/RX3  (via drill 0.3)
  Top 0.2: U3.30 15.65,28.75 14.8,29.6 v14.8,29.9 14.8,30.6 14.55,30.85 U3.38 | U6.4 17,16.75 v17,17.4
  Route15 0.2: v17,17.4 16.3,17.4 14.9,18.8 14.9,19.3 14.1,20.1 14.1,28.2 14.5,28.6 14.5,29.6 v14.8,29.9
RC2-0  (via drill 0.3)
  Top 0.2: U3.39 14.05,30.55 v14.2,30.4
  Route2 0.2: v14.2,30.4 13.3,31.3 5.8,31.3 v5.6,31.1
  Route15 0.2: v5.6,31.1 5.6,30.6 4.9,29.9 4.9,28 4.4,27.5 3.2,27.5 2.4,26.7 2.4,25.6 1.3,24.5 J8.7
RC-0  (via drill 0.3)
  Top 0.2: U6.2 v13.2,17.7
  Bottom 0.2: v13.2,17.7 10.5,17.7 5.4,22.8 5.4,26.98 J8.4
RC-1  (via drill 0.3)
  Top 0.2: U3.29 15.65,28.25 14.3,29.6 v13.9,29.6 13.55,29.95 U3.40
  Route2 0.2: v13.9,29.6 13.9,29.9 13.6,30.2 13.6,30.5 13.2,30.9 6.2,30.9 5.8,30.5 5.4,30.5 4.5,29.6 3.4,29.6 2.8,29 2.8,28.1 3.2,27.7 3.2,26.64 J8.6
RC-2  (via drill 0.3)
  Top 0.2: U3.37 15.05,30.85 15.4,30.5 v15.4,30.4
  Route2 0.2: v15.4,30.4 15.3,30.5 14.9,30.5 14.4,31 14.1,31 13.4,31.7 5.3,31.7 5,31.4 5,30.6 4.4,30 3.3,30 2.4,29.1 2.4,28 2.8,27.6 2.8,26.8 2.4,26.4 2.4,23.1 1.3,22 J8.9
RX1  (via drill 0.3)
  Top 0.2: U3.43 12.05,30.35 v11.7,30 | U4.18 7.95,2.75 v8.3,2.4
  Route15 0.2: v11.7,30 11.8,29.9 11.8,29.2 11.4,28.8 11.4,23 10.1,21.7 10.1,15.9 8.3,14.1 v8.3,2.4
RX2  (via drill 0.3)
  Top 0.2: U3.17 19.3,22.25 v19.3,21.8
  Route15 0.2: v19.3,21.8 19.4,21.9 19.4,35.5 21.5,37.6 22,37.6 23.1,38.7 J13.2
RX5
  Top 0.2: U3.54 4.65,27.25 4.5,27.1 3.2,27.1 2.9,26.8 2,26.8 1.3,27.5 J8.3
SCK  (via drill 0.3)
  Top 0.2: v21.3,16.1 21.1,15.9 U5.13 | v9.3,27.2 8.85,26.75 U3.55
  Bottom 0.2: v21.3,16.1 21,16.1 17,20.1 17,21.9 16.3,22.6 11,22.6 10,23.6 10,25.3 9.1,26.2 9.1,27 v9.3,27.2
SWC  (via drill 0.3)
  Top 0.2: U3.49 8.95,29.75 v9.2,29.5
  Bottom 0.2: v9.2,29.5 8.3,30.4 8.3,34.27 J11.2
SWD  (via drill 0.3)
  Top 0.2: U3.46 10.55,32.75 v10.5,32.8
  Route15 0.2: v10.5,32.8 8.7,34.6 8.7,37.22 J11.4
TX1  (via drill 0.3)
  Top 0.2: v11.2,29.4 11.9,29.4 12.55,30.05 U3.42 | U4.17 7.45,2.45 v7.5,2.4
  Route15 0.2: v11.2,29.4 11,29.2 11,23.1 9.7,21.8 9.7,16 7.9,14.2 7.9,2.8 v7.5,2.4
TX2  (via drill 0.3)
  Top 0.2: U3.16 17.05,23.65 v16.9,23.8
  Route15 0.2: v16.9,23.8 18.4,23.8 19,24.4 19,35.6 21.62,38.22 J13.3
TX5  (via drill 0.3)
  Top 0.2: U3.53 4.65,27.75 4.4,27.5 2.3,27.5 v2.2,27.4
  Bottom 0.2: v2.2,27.4 1.7,27.4 1.3,27 J8.5
USB_DETECT  (via drill 0.3)
  Top 0.2: U4.6 9.5,7 v9.6,7.1 9.8,7.3 9.8,7.85 C9.P$1 | R9.P$1 6.7,0.95 7.15,0.95 v7.3,1.1 | v10.8,21.6 10.7,21.5 10.3,21.5 10.05,21.25 U3.2
  Route15 0.2: v7.3,1.1 7.8,1.1 8.9,2.2 8.9,2.6 8.7,2.8 8.7,7.1 | 8.7,7.1 v9.6,7.1 | 8.7,7.1 8.7,14 10.5,15.8 10.5,21.3 v10.8,21.6
VBAT  (via drill 0.3)
  Top 0.2: 16.4,6.7 16.4,6.95 U1.3 | R3.P$2 16.4,5.5 16.4,5.7 | v13.5,4.2 13.5,4.65 | 15.35,4.65 15.35,4.8 v15.5,4.8
  Top 0.4: C4.P$1 9.8,1.3 9.8,2.1 v11.2,3.5 11.3,3.6 11.3,4.5 C3.P$1
  Top 0.9: C3.P$1 12.1,4.65 13.5,4.65 D1.C 15.35,4.65 v15.5,4.8 16.4,5.7 16.4,6.7
  Route15 0.6: v24.3,10.1 24.3,9.7 v24.3,9.4
  Route15 1: 24.3,9.7 23.2,9.7 22.2,8.7 19.4,8.7 14.7,4 11.7,4 v11.2,3.5
  Bottom 0.2: 22.5,9.22 22.9,9.22 J4.2 | 24,9.7 v24.3,9.4
  Bottom 0.6: J4.1 24.2,10.2 v24.3,10.1 v24.3,9.4 24.1,9.2 J4.2 | 22.73,9.7 24,9.7 | 22.5,9.22 22.5,10.1
VIN
  Top 0.2: D1.A 14.5,1.7 15.8,1.7 | J1.1A 16.54,0.5 14,0.5 14,1.1 14.5,1.1 D1.A | 14.4,1.3 14.5,1.3 D1.A
  Top 0.6: D1.A 14.3,1.35 14.3,0.8 16,0.8 | 14.4,1.3 16.1,1.3
  Top 1.2: 16.54,1.3 J1.1A J1.1
  Bottom 1: J1.1 18.28,1.4 JP1.P$1
XOR  (via drill 0.3)
  Top 0.2: U6.1 14.3,18.65 v14.3,19.1 | v13.9,28.8 13.05,29.65 U3.41 13.05,32.55 12.9,32.7 11.5,32.7 10.8,33.4 9.8,33.4 9.3,33.9 8.4,33.9 7.7,34.6 7.35,34.6 R12.P$1
  Route15 0.2: v14.3,19.1 14.3,19.4 13.7,20 13.7,28.6 v13.9,28.8

### Text on the board
tPlace: G | P0 | P1 | B | V | GND | RX | TX | 5V
bPlace: SWDIO | TX2 | GND | RX2 | GND | MOT1 | SWDCLK | +3V3 | GND | AUX1 | AUX0 | GND | GND | GND | RX | R0 | MOT2 | TX | R1 | R20 | 3V3 | R2 | 5V | MOT3 | STorM32 NT v4.1 | (C) Krattworks 2023 | VBAT | VBAT | GND | 5V | NT-TX | NT-RX | GND | + | -
tDocu: GND | POT-0 | POT-1 | BUT | +3V3 | TX2 | RX2 | GND | MOT1 | GND | GND | GND | MOT2 | RX | RC-0 | TX | RC-1 | RC2-0 | +3V3 | RC-2 | +5V | MOT3 | USB | GND | NT-RX | NT-TX | +5V | GND | NT-RX | NT-TX | +5V | +VIN | GND
bDocu: AUX-1 | AUX-0 | GND | TX2 | RX2 | GND | SWDIO | GND | SWDCLK | +3V3 | GND | MOT1 | GND | GND | RX | RC-0 | TX | RC-1 | RC2-0 | +3V3 | MOT2 | RC-2 | +5V | MOT3 | VBAT | VBAT | GND | +5V | NT-TX | NT-RX | GND | +VIN | GND